# EAGLE design ARE_adaptadora_AT90-8535_40pin (EAGLE 6.5.0)
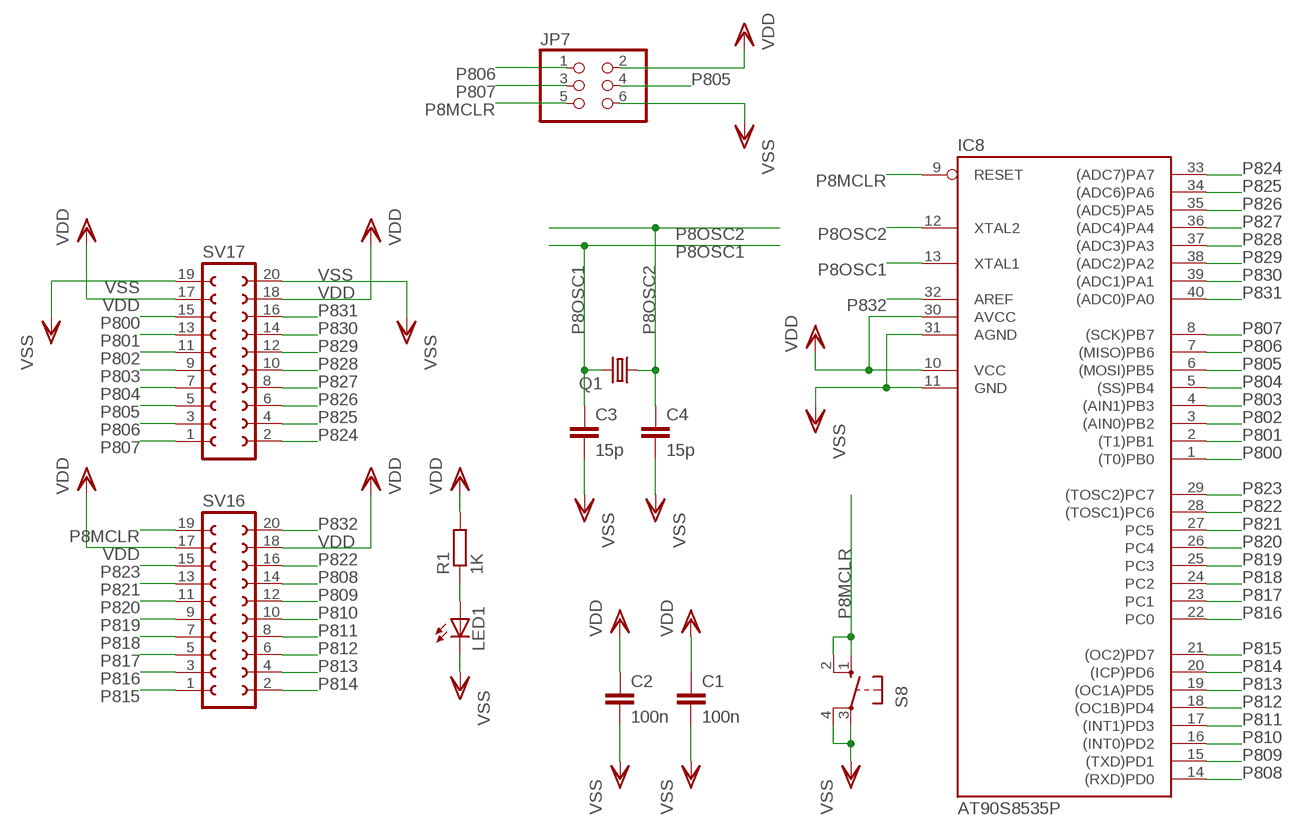
[diagram p0: schematic, sheet 1]

## Parts
C1  100n  C-EUC0805  [C0805]
C2  100n  C-EUC0805  [C0805]
C3  15p  C-EUC0805  [C0805]
C4  15p  C-EUC0805  [C0805]
IC8  AT90S8535P  [DIL40]
JP7  PINHD-2X3  [2X03]
LED1  LED3MM  [LED3MM]
Q1  CRYSTALHC18U-V  [HC18U-V]
R1  1K  R-EU_R0805  [R0805]
S8  10-XX  [B3F-10XX]
SV16  FE10-2W  [FE10-2W]
SV17  FE10-2W  [FE10-2W]

## Nets
N$10: LED1.A R1.1
P8MCLR: IC8.9(RESET) JP7.5 S8.1(S) S8.2(S1) SV16.19
P8OSC1: C3.1 IC8.13(XTAL1) Q1.2
P8OSC2: C4.1 IC8.12(XTAL2) Q1.1
P800: IC8.1((T0)PB0) SV17.15
P801: IC8.2((T1)PB1) SV17.13
P802: IC8.3((AIN0)PB2) SV17.11
P803: IC8.4((AIN1)PB3) SV17.9
P804: IC8.5((SS)PB4) SV17.7
P805: IC8.6((MOSI)PB5) JP7.4 SV17.5
P806: IC8.7((MISO)PB6) JP7.1 SV17.3
P807: IC8.8((SCK)PB7) JP7.3 SV17.1
P808: IC8.14((RXD)PD0) SV16.14
P809: IC8.15((TXD)PD1) SV16.12
P810: IC8.16((INT0)PD2) SV16.10
P811: IC8.17((INT1)PD3) SV16.8
P812: IC8.18((OC1B)PD4) SV16.6
P813: IC8.19((OC1A)PD5) SV16.4
P814: IC8.20((ICP)PD6) SV16.2
P815: IC8.21((OC2)PD7) SV16.1
P816: IC8.22(PC0) SV16.3
P817: IC8.23(PC1) SV16.5
P818: IC8.24(PC2) SV16.7
P819: IC8.25(PC3) SV16.9
P820: IC8.26(PC4) SV16.11
P821: IC8.27(PC5) SV16.13
P822: IC8.28((TOSC1)PC6) SV16.16
P823: IC8.29((TOSC2)PC7) SV16.15
P824: IC8.33((ADC7)PA7) SV17.2
P825: IC8.34((ADC6)PA6) SV17.4
P826: IC8.35((ADC5)PA5) SV17.6
P827: IC8.36((ADC4)PA4) SV17.8
P828: IC8.37((ADC3)PA3) SV17.10
P829: IC8.38((ADC2)PA2) SV17.12
P830: IC8.39((ADC1)PA1) SV17.14
P831: IC8.40((ADC0)PA0) SV17.16
P832: IC8.32(AREF) SV16.20
VDD: C1.1 C2.1 IC8.10(VCC) IC8.30(AVCC) JP7.2 R1.2 SV16.17 SV16.18 SV17.17 SV17.18
VSS: C1.2 C2.2 C3.2 C4.2 IC8.11(GND) IC8.31(AGND) JP7.6 LED1.K(C) S8.3(P) S8.4(P1) SV17.19 SV17.20

## Library data of the parts
C1-C4 = rcl:C-EU: CAPACITOR, European symbol
IC8 = atmel:AT90*8535P: MICROCONTROLLER 8 Kbytes FLASH 512 bytes SRAM 512 bytes EEPROM UART 8-channel 10 bit ADC; OC_FARNELL: unknown; OC_NEWARK: unknown
JP7 = pinhead:PINHD-2X3: PIN HEADER
LED1 = SparkFun:LED: LEDs Standard schematic elements and footprints for 5mm, 3mm, 1206, and 0603 sized LEDs. 5mm - Spark Fun Electronics SKU : COM-00529 (and others)
Q1 = crystal:CRYSTAL: CRYSTAL; OC_FARNELL: unknown; OC_NEWARK: unknown
R1 = rcl:R-EU_: RESISTOR, European symbol
S8 = switch-omron:10-XX: OMRON SWITCH; MPN: B3F-1000; OC_FARNELL: 176432; OC_NEWARK: 36M3542
SV16 SV17 = con-lsta:FE10-2W: FEMALE HEADER; OC_FARNELL: unknown; OC_NEWARK: unknown

## Board
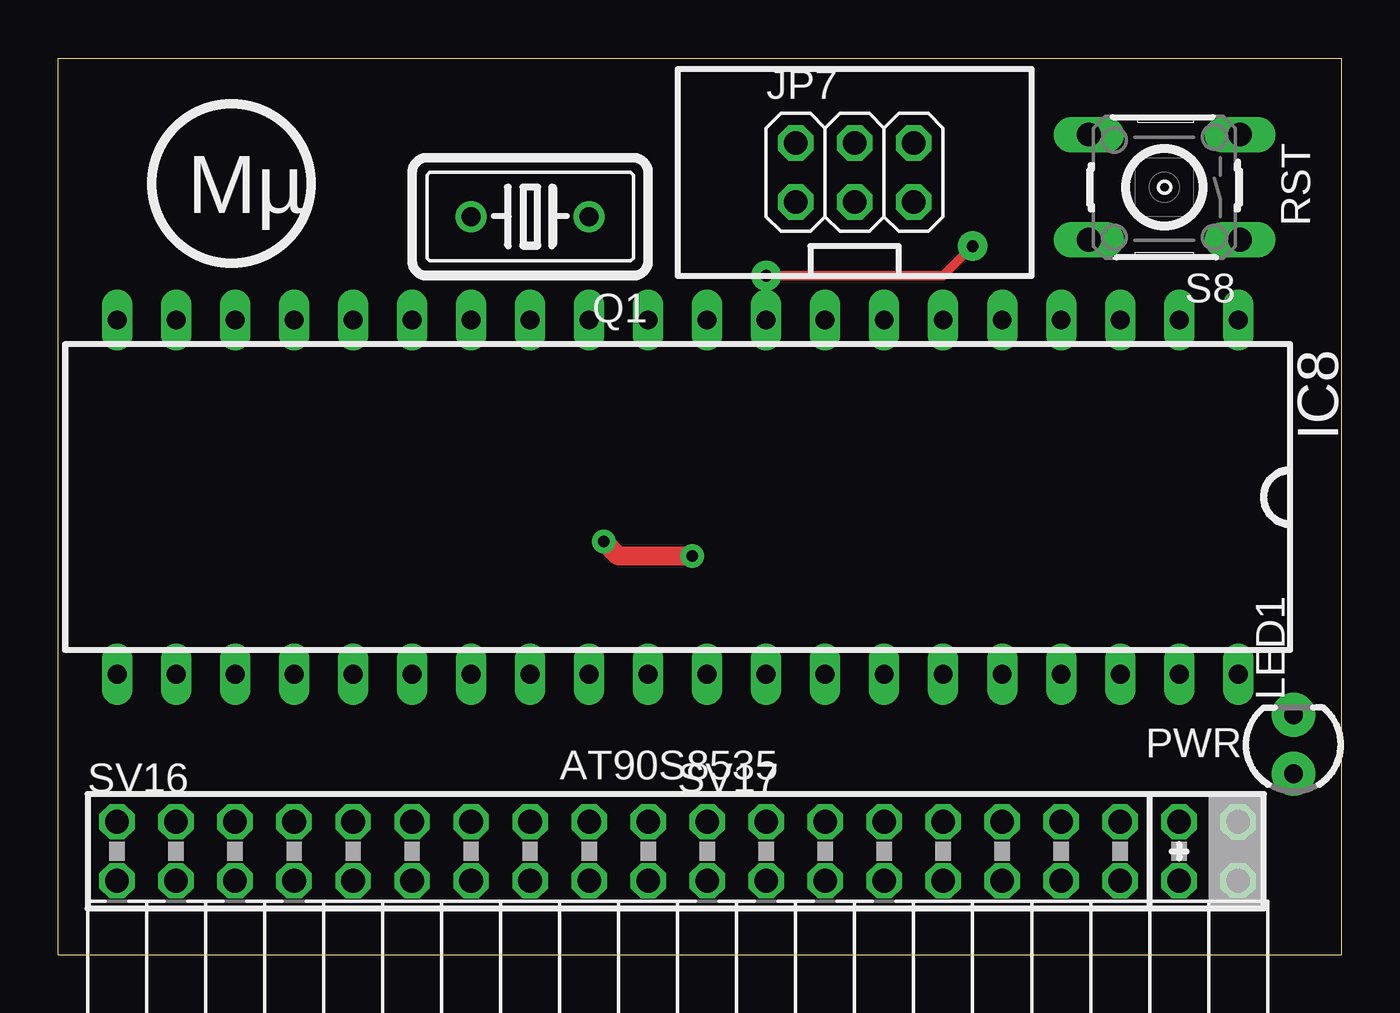
[diagram p1: board, top side]
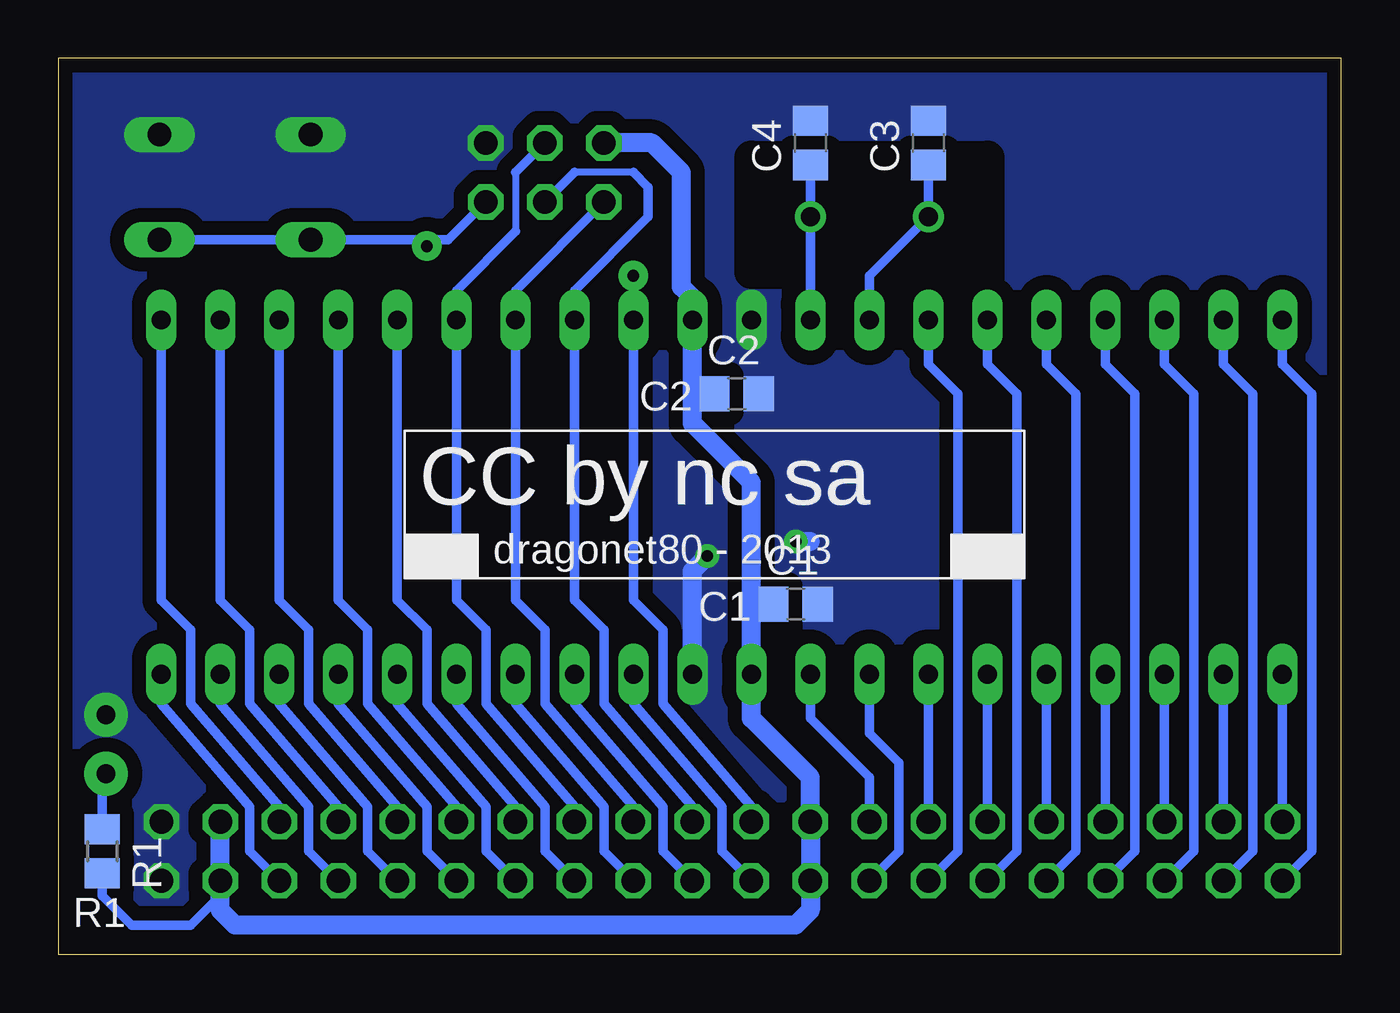
[diagram p2: board, bottom side, seen from below]

Size 55.24 x 38.58 mm. Coordinates in mm from the lower left corner, seen from the top.
Outline: 0,0 55.24,0 55.24,38.58 0,38.58 0,0
Copper layers (1*16): Top 0.035mm / dielectric 1.5mm / Bottom 0.035mm
Design rules "ITEADstudio_DRC": minimum track width 6mil, minimum drill 12mil, track to track 6mil, track to pad 6mil, pad to pad 6mil, via to via 6mil, smd to smd 0mil, copper to edge 10mil, drill to drill 10mil, minimum pad ring 10mil, minimum via ring 6mil, stop-mask expansion 2mil, vias tented up to drill 100mil, thermal gap 10mil
bRestrict: area 15.2,29.4 to 25.4,34.3

### Footprints (pad centres in the part's own frame; a part is rotated, then mirrored left to right if it is on the bottom)
C0805 = smd 1.3 x 1.5: 1 -0.95,0; 2 0.95,0
DIL40 = drill 0.813 long: 1 -24.13,-7.62; 2 -21.59,-7.62; 3 -19.05,-7.62; 4 -16.51,-7.62; 5 -13.97,-7.62; 6 -11.43,-7.62; 7 -8.89,-7.62; 8 -6.35,-7.62; 9 -3.81,-7.62; 10 -1.27,-7.62; 11 1.27,-7.62; 12 3.81,-7.62; 13 6.35,-7.62; 14 8.89,-7.62; 15 11.43,-7.62; 16 13.97,-7.62; 17 16.51,-7.62; 18 19.05,-7.62; 19 21.59,-7.62; 20 24.13,-7.62; 21 24.13,7.62; 22 21.59,7.62; 23 19.05,7.62; 24 16.51,7.62; 25 13.97,7.62; 26 11.43,7.62; 27 8.89,7.62; 28 6.35,7.62; 29 3.81,7.62; 30 1.27,7.62; 31 -1.27,7.62; 32 -3.81,7.62; 33 -6.35,7.62; 34 -8.89,7.62; 35 -11.43,7.62; 36 -13.97,7.62; 37 -16.51,7.62; 38 -19.05,7.62; 39 -21.59,7.62; 40 -24.13,7.62
2X03 = drill 1.016 octagon: 1 -2.54,-1.27; 2 -2.54,1.27; 3 0,-1.27; 4 0,1.27; 5 2.54,-1.27; 6 2.54,1.27
LED3MM = drill 0.813 pad 1.88: A -1.27,0; K 1.27,0
HC18U-V = drill 0.813: 1 -2.54,0; 2 2.54,0
R0805 = smd 1.3 x 1.5: 1 -0.95,0; 2 0.95,0
B3F-10XX = drill 1.016 long: 1 -3.251,2.261; 2 3.251,2.261; 3 -3.251,-2.261; 4 3.251,-2.261
FE10-2W = drill 1.016 octagon: 1 -11.43,1.27; 2 -11.43,-1.27; 3 -8.89,1.27; 4 -8.89,-1.27; 5 -6.35,1.27; 6 -6.35,-1.27; 7 -3.81,1.27; 8 -3.81,-1.27; 9 -1.27,1.27; 10 -1.27,-1.27; 11 1.27,1.27; 12 1.27,-1.27; 13 3.81,1.27; 14 3.81,-1.27; 15 6.35,1.27; 16 6.35,-1.27; 17 8.89,1.27; 18 8.89,-1.27; 19 11.43,1.27; 20 11.43,-1.27

### Placement (x,y rotation side)
C1  23.49,15.08 0 bottom
C2  26.03,24.13 0 bottom
C3  17.78,34.92 90 bottom
C4  22.86,34.92 90 bottom
IC8  26.67,19.68 180 top
JP7  34.29,33.66 0 top
LED1  53.18,9.05 90 top
Q1  20.32,31.75 180 top
R1  53.34,4.45 270 bottom
S8  47.62,33.02 180 top
SV16  13.97,4.45 0 top
SV17  39.37,4.45 0 top

### Tracks (layer width: path | path; a pad name or v marks a point on that pad's centre or on a via)
N$10
  Bottom 0.406: R1.1 53.34,7.62 LED1.A
P8MCLR  (via drill 0.5 pad 1.27)
  Top 0.406: v30.48,29.21 38.1,29.21 v39.37,30.48
  Bottom 0.406: 39.37,30.76 S8.2 S8.1 | 39.37,30.76 38.46,30.76 JP7.5 | v30.48,29.21 IC8.9 30.48,15.24 29.21,13.97 29.21,10.79 25.4,6.35 SV16.19 | 39.37,30.76 v39.37,30.48
P8OSC1
  Bottom 0.406: C3.1 Q1.2 20.32,29.21 IC8.13
P8OSC2
  Bottom 0.406: IC8.12 Q1.1 C4.1
P800
  Bottom 0.406: IC8.1 50.8,15.24 49.53,13.97 49.53,10.79 45.72,6.35 SV17.15
P801
  Bottom 0.406: IC8.2 48.26,15.24 46.99,13.97 46.99,10.79 43.18,6.35 SV17.13
P802
  Bottom 0.406: IC8.3 45.72,15.24 44.45,13.97 44.45,10.79 40.64,6.35 SV17.11
P803
  Bottom 0.406: IC8.4 43.18,15.24 41.91,13.97 41.91,10.79 38.1,6.35 SV17.9
P804
  Bottom 0.406: IC8.5 40.64,15.24 39.37,13.97 39.37,10.79 35.56,6.35 SV17.7
P805
  Bottom 0.305: 35.56,33.66 35.56,31.11
  Bottom 0.406: JP7.4 35.56,33.66 | 35.56,31.11 38.1,28.57 IC8.6 38.1,15.24 36.83,13.97 36.83,10.79 33.02,6.35 SV17.5
P806
  Bottom 0.406: JP7.1 35.56,28.57 IC8.7 35.56,15.24 34.29,13.97 34.29,10.79 30.48,6.35 SV17.3
P807
  Bottom 0.305: 30.48,33.66 33.02,33.66
  Bottom 0.406: 30.48,33.66 29.84,33.02 29.84,31.75 33.02,28.57 IC8.8 33.02,15.24 31.75,13.97 31.75,10.79 27.94,6.35 SV17.1 | 33.02,33.66 JP7.3
P808
  Bottom 0.406: IC8.14 17.78,25.4 16.51,24.13 16.51,4.45 SV16.14
P809
  Bottom 0.406: IC8.15 15.24,25.4 13.97,24.13 13.97,4.45 SV16.12
P810
  Bottom 0.406: IC8.16 12.7,25.4 11.43,24.13 11.43,4.45 SV16.10
P811
  Bottom 0.406: IC8.17 10.16,25.4 8.89,24.13 8.89,4.45 SV16.8
P812
  Bottom 0.406: IC8.18 7.62,25.4 6.35,24.13 6.35,4.45 SV16.6
P813
  Bottom 0.406: IC8.19 5.08,25.4 3.81,24.13 3.81,4.45 SV16.4
P814
  Bottom 0.406: IC8.20 2.54,25.4 1.27,24.13 1.27,4.45 SV16.2
P815
  Bottom 0.406: IC8.21 SV16.1
P816
  Bottom 0.406: IC8.22 SV16.3
P817
  Bottom 0.406: IC8.23 SV16.5
P818
  Bottom 0.406: IC8.24 SV16.7
P819
  Bottom 0.406: IC8.25 SV16.9
P820
  Bottom 0.406: IC8.26 SV16.11
P821
  Bottom 0.406: IC8.27 SV16.13
P822
  Bottom 0.406: IC8.28 20.32,9.52 19.05,8.25 19.05,4.45 SV16.16
P823
  Bottom 0.406: IC8.29 22.86,10.16 20.32,7.62 SV16.15
P824
  Bottom 0.406: IC8.33 33.02,10.79 29.21,6.35 29.21,4.45 SV17.2
P825
  Bottom 0.406: IC8.34 35.56,10.79 31.75,6.35 31.75,4.45 SV17.4
P826
  Bottom 0.406: IC8.35 38.1,10.79 34.29,6.35 34.29,4.45 SV17.6
P827
  Bottom 0.406: IC8.36 40.64,10.79 36.83,6.35 36.83,4.45 SV17.8
P828
  Bottom 0.406: IC8.37 43.18,10.79 39.37,6.35 39.37,4.45 SV17.10
P829
  Bottom 0.406: IC8.38 45.72,10.79 41.91,6.35 41.91,4.45 SV17.12
P830
  Bottom 0.406: IC8.39 48.26,10.79 44.45,6.35 44.45,4.45 SV17.14
P831
  Bottom 0.406: IC8.40 50.8,10.79 46.99,6.35 46.99,4.45 SV17.16
P832
  Bottom 0.406: IC8.32 30.48,10.79 26.67,6.35 26.67,4.45 SV16.20
VDD
  Bottom 0.406: SV17.18 48.26,2.54 49.53,1.27 52.07,1.27 53.34,2.54 R1.2 | C2.1 27.94,24.13 | C1.1 25.4,15.08
  Bottom 0.813: SV17.17 SV17.18 48.26,1.91 47.62,1.27 23.49,1.27 22.86,1.91 SV16.18 SV16.17 22.86,7.62 25.4,10.16 IC8.30 25.4,15.08 25.4,20.32 27.94,22.86 27.94,24.13 IC8.10 27.94,28.26 28.42,28.73 28.42,33.66 29.69,34.92 JP7.2
VSS  (via drill 0.5 pad 1.02)
  Top 0.813: v27.3,17.14 24.13,17.14 v23.49,17.78
  Bottom 0.813: IC8.31 27.94,16.51 v27.3,17.14 | v23.49,17.78 22.86,17.78
  pour Bottom (isolate 0.61, no thermals): 0,0 0,38.58 55.24,38.58 55.24,0

### Text on the board
_tsilk: RST | Mµ | PWR | AT90S8535
_bsilk: C2 | CC by nc sa | dragonet80 - 2013 | C1 | R1